# EAGLE design FDevT (EAGLE 9.1.1)
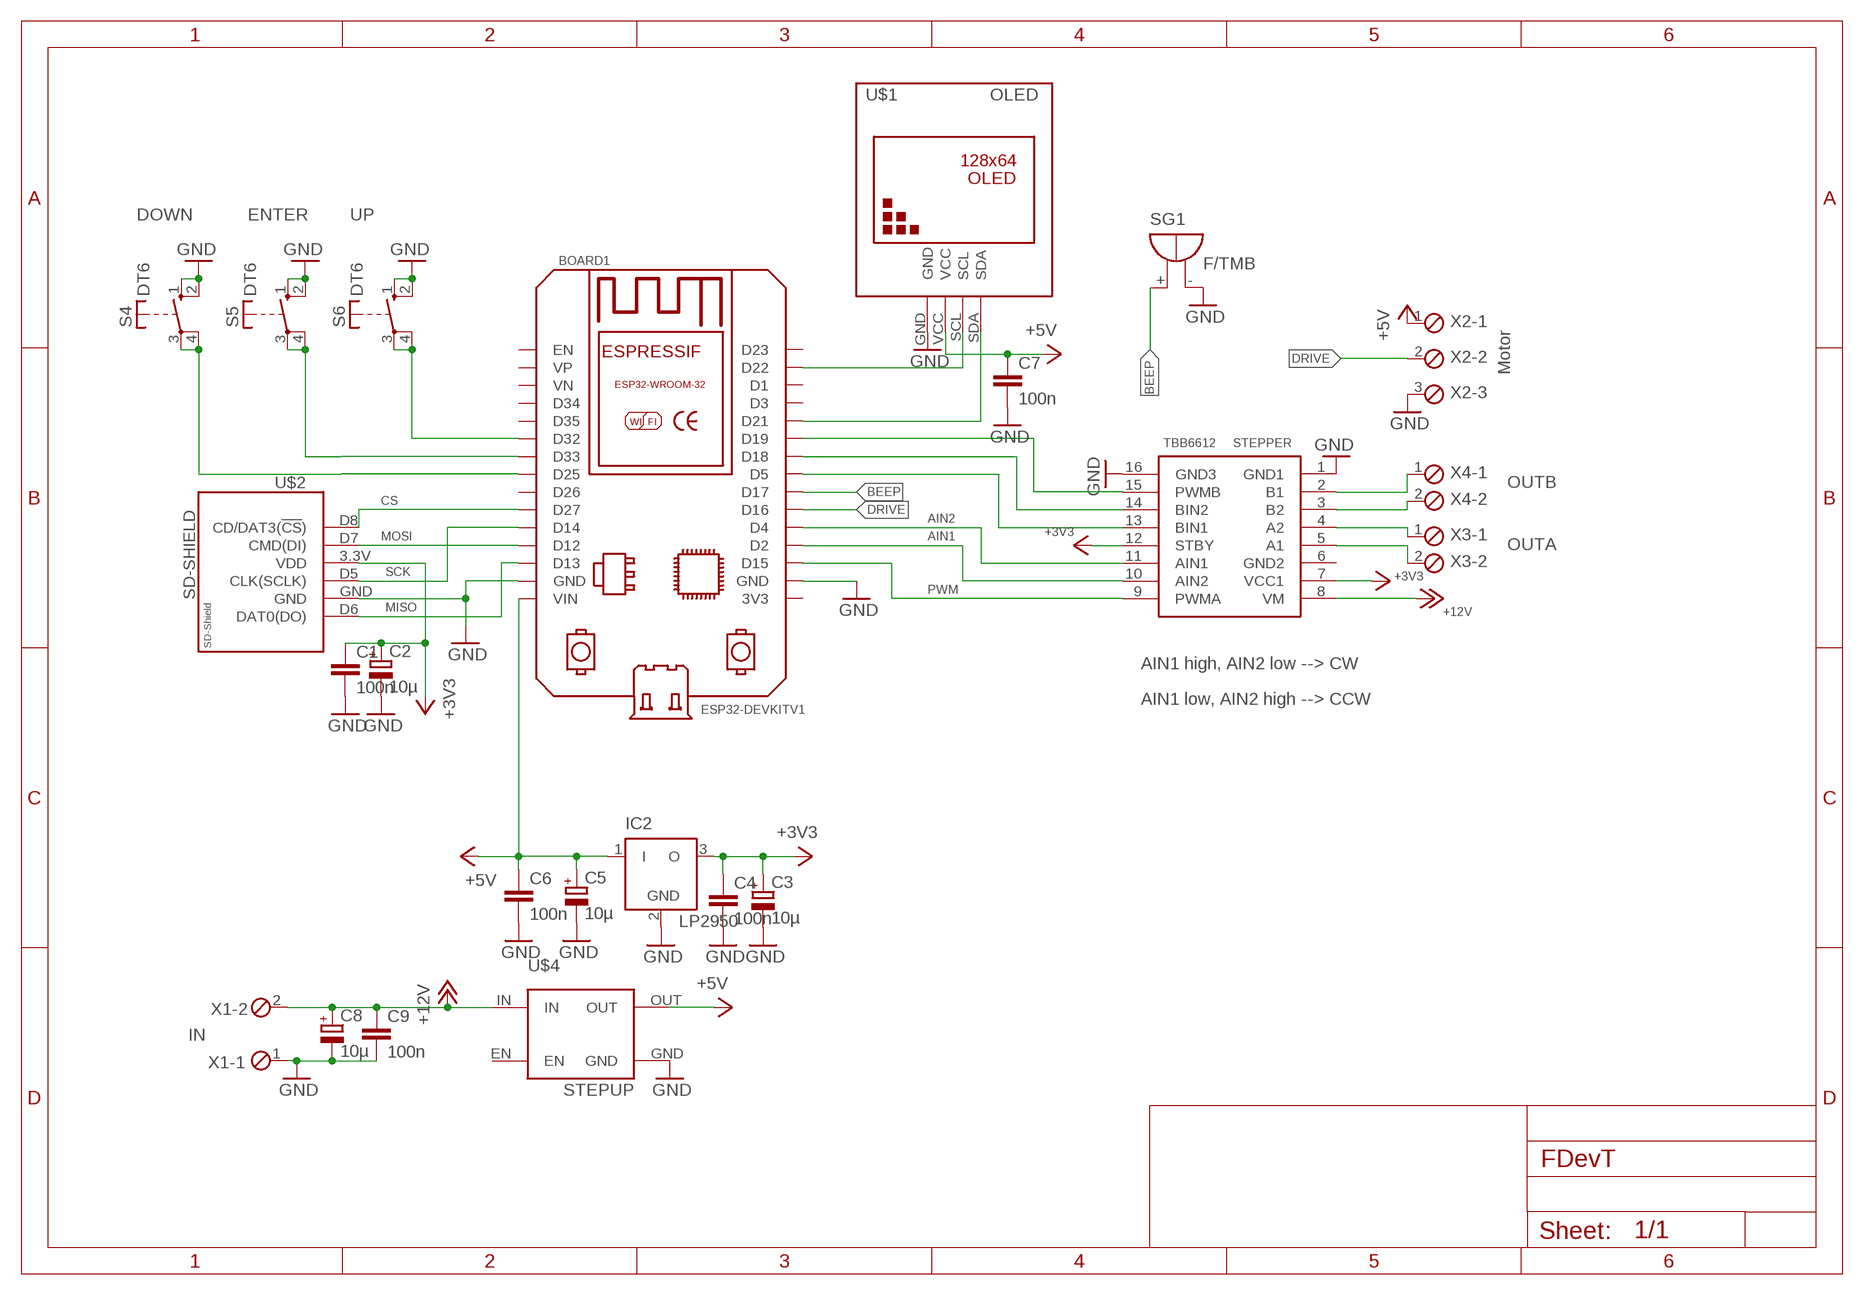
[diagram p0: schematic, sheet 1]

## Parts
BOARD1  ESP32DEVKITV1  [ESP32-DEVKITV1]
C1  100n  C-EUC0805  [C0805]
C2  10µ  CPOL-EUSMCB  [SMC_B]
C3  10µ  CPOL-EUSMCB  [SMC_B]
C4  100n  C-EUC0805  [C0805]
C5  10µ  CPOL-EUSMCB  [SMC_B]
C6  100n  C-EUC0805  [C0805]
C7  100n  C-EUC0805  [C0805]
C8  10µ  CPOL-EUSMCB  [SMC_B]
C9  100n  C-EUC0805  [C0805]
IC2  LP2950  [DPACK]
S4  DT6  [DT6]
S5  DT6  [DT6]
S6  DT6  [DT6]
SG1  F/TMB  [F/TMB]
STEPPER  TBB6612  [DRIVER]
U$1  OLED  [SIP]
U$2  SD-SHIELD  [SD_SHIELD]
U$4  STEPUP  [STEPUP]
X1  IN  MPT2  [2POL254]
X2  Motor  MPT3  [3POL254]
X3  OUTA  MPT2  [2POL254]
X4  OUTB  MPT2  [2POL254]

## Nets
+3V3: C1.1 C2.+ C3.+ C4.1 IC2.3(O) STEPPER.7(VCC1) STEPPER.12(STBY) U$2.3.3V(VDD)
+5V: BOARD1.VIN C5.+ C6.1 C7.1 IC2.1(I) U$1.VCC U$4.OUT X2.1
+12V: C8.+ C9.1 STEPPER.8(VM) U$4.IN X1.2
AIN1: BOARD1.D2 STEPPER.10(AIN2)
AIN2: BOARD1.D4 STEPPER.11(AIN1)
BEEP: BOARD1.D17 SG1.+
CS: BOARD1.D27 U$2.D8(CD/DAT3(!CS!))
DOWN: BOARD1.D25 S4.3(P) S4.4(P)
DRIVE: BOARD1.D16 X2.2
ENTER: BOARD1.D33 S5.3(P) S5.4(P)
GND: BOARD1.GND BOARD1.GND@1(GND) C1.2 C2.- C3.- C4.2 C5.- C6.2 C7.2 C8.- C9.2 IC2.2(GND) S4.1(S) S4.2(S) S5.1(S) S5.2(S) S6.1(S) S6.2(S) SG1.- STEPPER.1(GND1) STEPPER.16(GND3) U$1.GND U$2.GND U$4.GND X1.1 X2.3
MISO: BOARD1.D13 U$2.D6(DAT0(DO))
MOSI: BOARD1.D12 U$2.D7(CMD(DI))
N$1: BOARD1.D22 U$1.SCL
N$2: BOARD1.D21 U$1.SDA
N$3: STEPPER.5(A1) X3.2
N$4: STEPPER.4(A2) X3.1
N$5: BOARD1.D5 STEPPER.13(BIN1)
N$6: BOARD1.D18 STEPPER.14(BIN2)
N$7: BOARD1.D19 STEPPER.15(PWMB)
N$8: STEPPER.3(B2) X4.2
N$9: STEPPER.2(B1) X4.1
PWM: BOARD1.D15 STEPPER.9(PWMA)
SCK: BOARD1.D14 U$2.D5(CLK(SCLK))
UP: BOARD1.D32 S6.3(P) S6.4(P)
Unconnected: BOARD1.3V3 BOARD1.D1 BOARD1.D3 BOARD1.D23 BOARD1.D26 BOARD1.D34 BOARD1.D35 BOARD1.EN BOARD1.VN BOARD1.VP STEPPER.6(GND2) U$4.EN

## Notes on the sheet
- AIN1 high, AIN2 low --> CW
- AIN1 low, AIN2 high --> CCW

## Library data of the parts
BOARD1 = ESP32-DEVKITV1:ESP32DEVKITV1: https://github.com/shridattdudhat
C1 C4 C6 C7 C9 = rcl:C-EU: CAPACITOR, European symbol
C2 C3 C5 C8 = rcl:CPOL-EU: POLARIZED CAPACITOR, European symbol
IC2 = linear:LP2950: 100 mA, Low Power Low Dropout Voltage Regulator Source: http://www.onsemi.com/pub/Collateral/LP2950-D.PDF
S4-S6 = switch-misc:DT: ITT SWITCH
SG1 = buzzer:F/TMB: BUZZER Source: Buerklin; OC_FARNELL: unknown; OC_NEWARK: unknown
STEPPER = TBB6612d:TBB6612
U$1 = OLED:OLED: I2C 0.91"128x32 OLED
U$2 = sd-mmc:SD-SHIELD
U$4 = AMESYS_neu:STEPUP
X1 X3 X4 = con-phoenix-254:MPT2: PHOENIX CONNECTOR; OC_FARNELL: unknown; OC_NEWARK: unknown
X2 = con-phoenix-254:MPT3: PHOENIX CONNECTOR; OC_FARNELL: unknown; OC_NEWARK: unknown

## Board
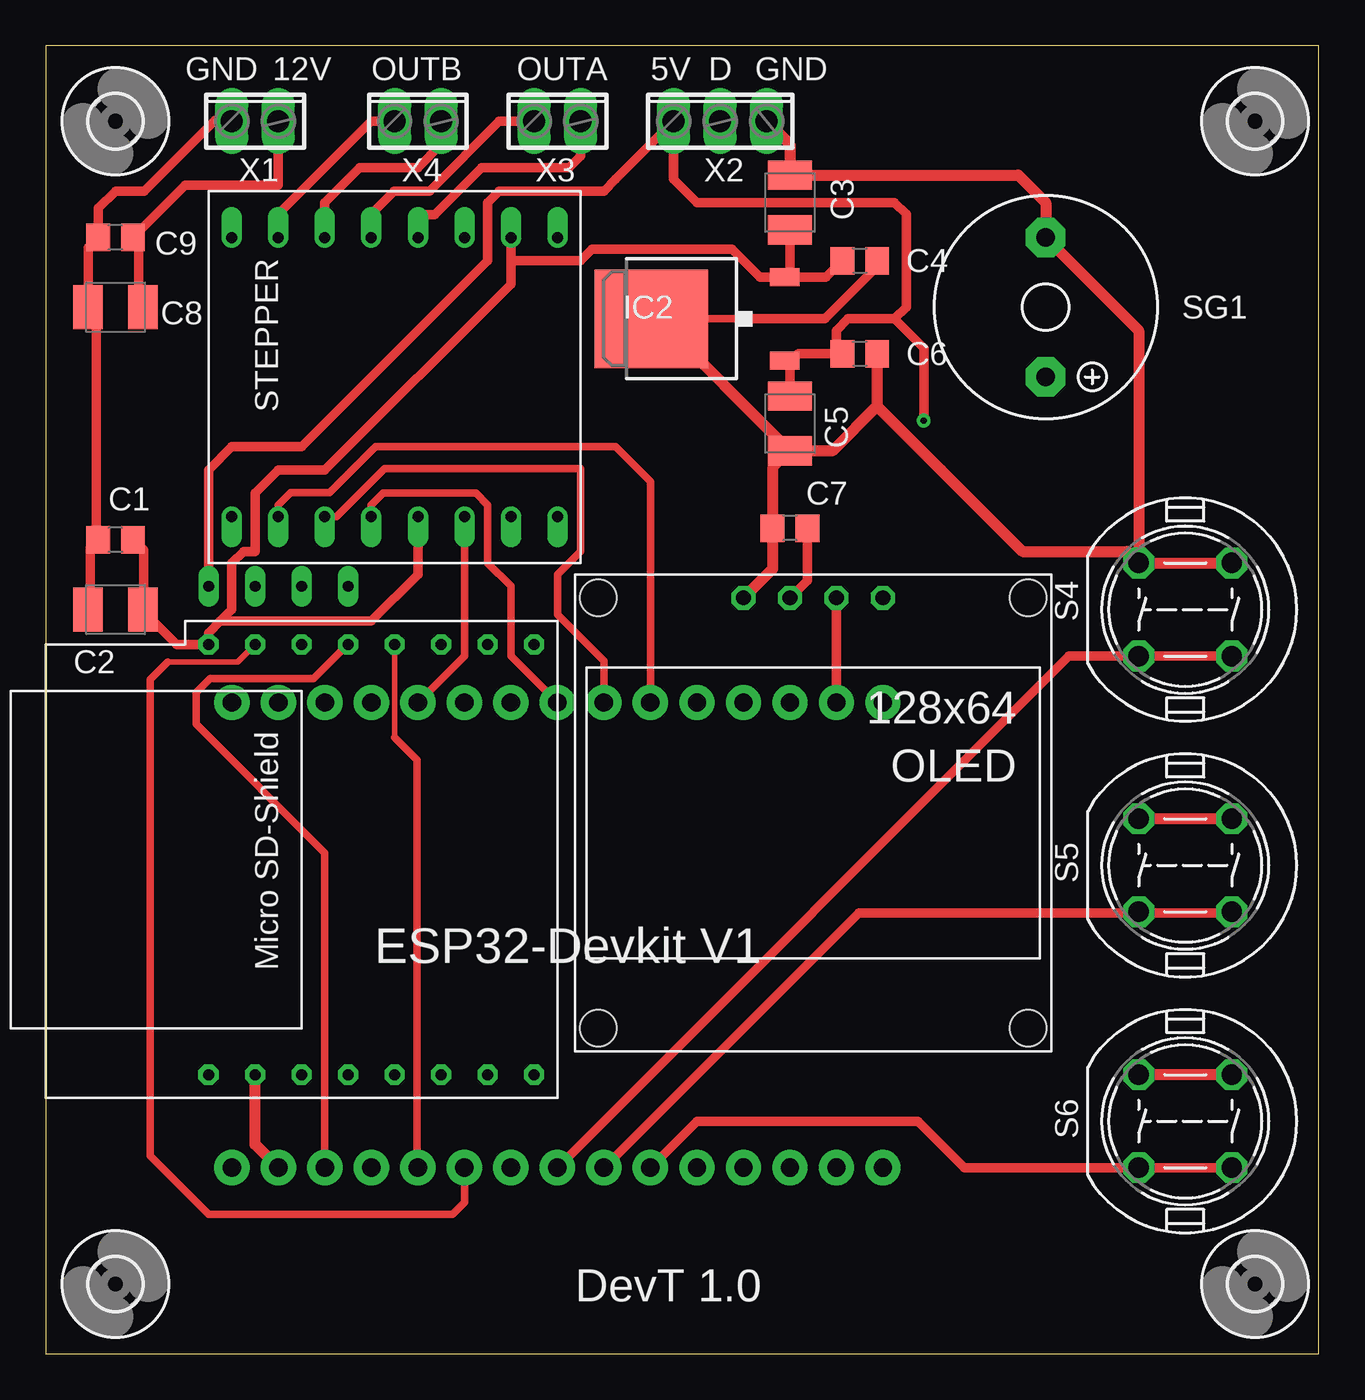
[diagram p1: board, top side]
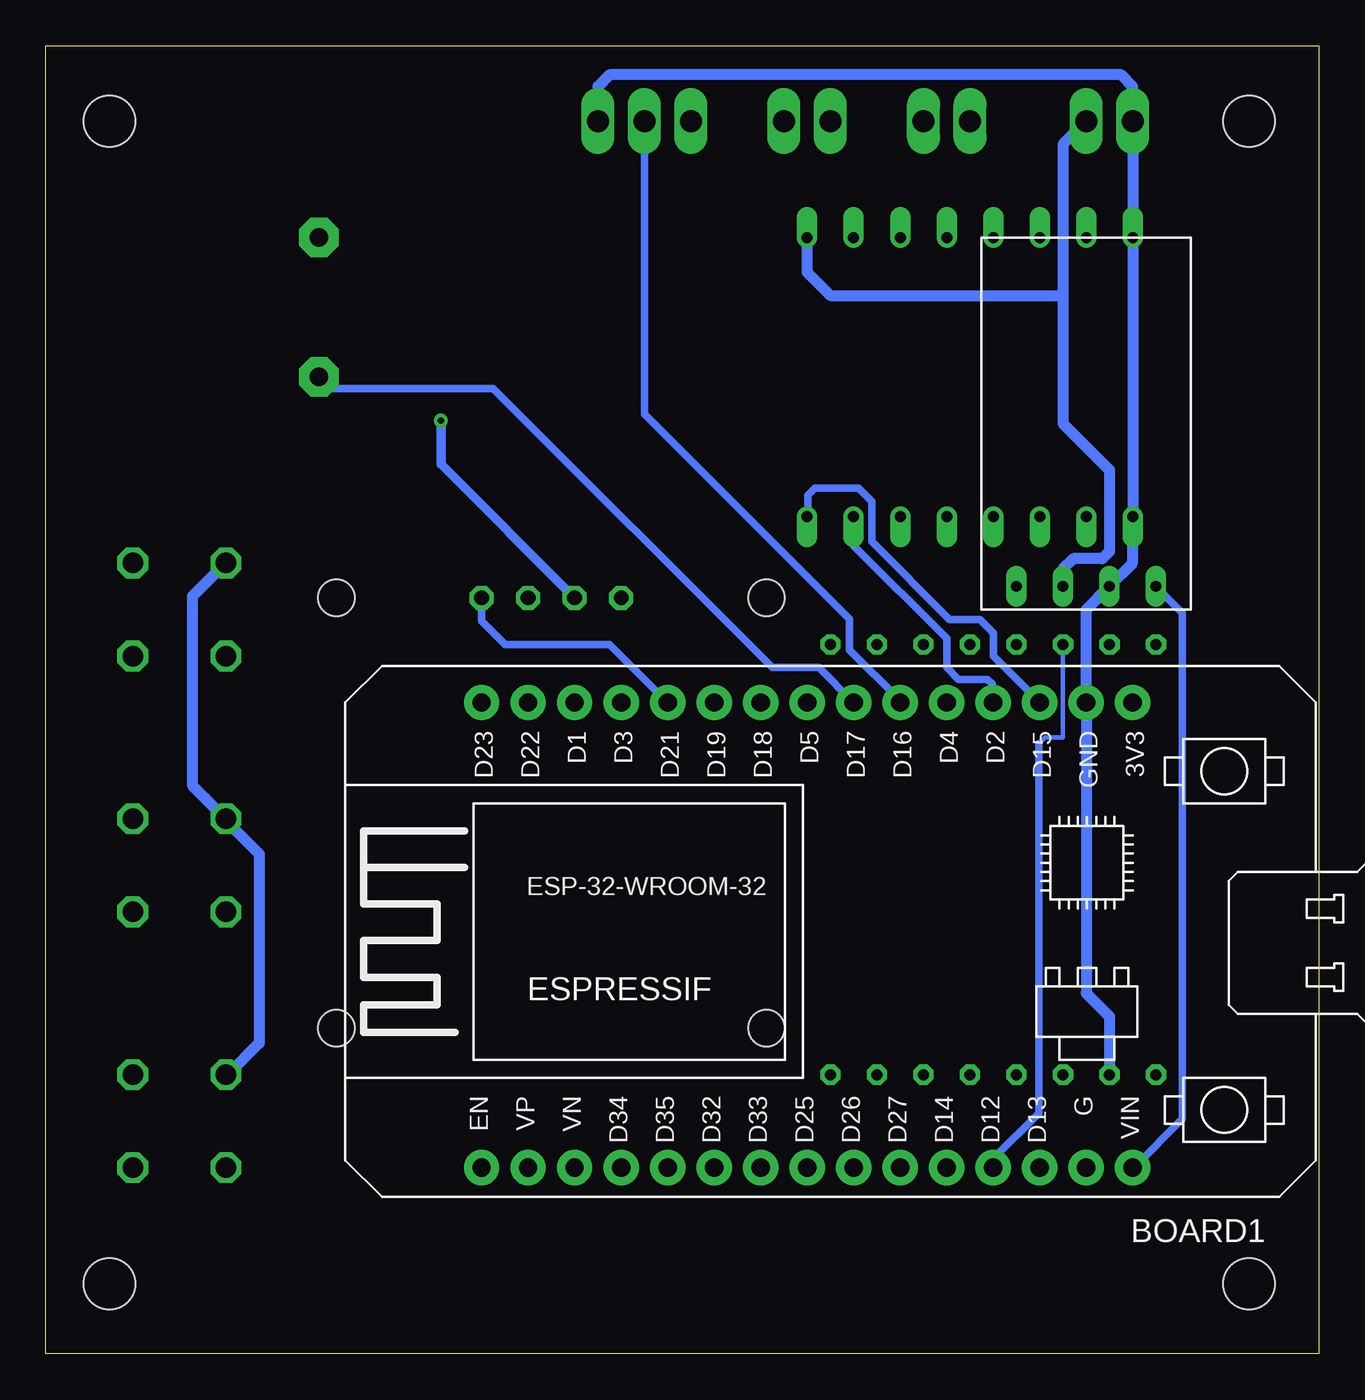
[diagram p2: board, bottom side, seen from below]

Size 69.52 x 71.43 mm. Coordinates in mm from the lower left corner, seen from the top.
Outline: 0,0 69.52,0 69.52,71.43 0,71.43 0,0
Copper layers (1*16): Top 0.035mm / dielectric 1.5mm / Bottom 0.035mm
Design rules "default": minimum track width 6mil, minimum drill 0.35mm, track to track 6mil, track to pad 6mil, pad to pad 6mil, via to via 6mil, smd to smd 6mil, copper to edge 40mil, drill to drill 6mil, minimum pad ring 10mil, minimum via ring 8mil, stop-mask expansion 4mil, vias tented up to drill 0mil, thermal gap 10mil

### Footprints (pad centres in the part's own frame; a part is rotated, then mirrored left to right if it is on the bottom)
ESP32-DEVKITV1 = drill 1 pad 1.93: 3V3 0,0; D1 30.48,0; D2 7.62,0; D3 27.94,0; D4 10.16,0; D5 17.78,0; D12 7.62,25.4; D13 5.08,25.4; D14 10.16,25.4; D15 5.08,0; D16 12.7,0; D17 15.24,0; D18 20.32,0; D19 22.86,0; D21 25.4,0; D22 33.02,0; D23 35.56,0; D25 17.78,25.4; D26 15.24,25.4; D27 12.7,25.4; D32 22.86,25.4; D33 20.32,25.4; D34 27.94,25.4; D35 25.4,25.4; EN 35.56,25.4; GND 2.54,25.4; GND@1 2.54,0; VIN 0,25.4; VN 30.48,25.4; VP 33.02,25.4
C0805 = smd 1.3 x 1.5: 1 -0.95,0; 2 0.95,0
SMC_B = smd 1.6 x 2.4: + -1.5,0; - 1.5,0
DPACK = smd 1 x 1.6: 1 -2.28,-4.8; 3 2.28,-4.8 | smd 5.4 x 6.2: 2 0,2.5
DT6 = drill 1.118 octagon: 1 -2.54,2.54; 2 2.54,2.54; 3 2.54,-2.54; 4 -2.54,-2.54
F/TMB = drill 1.016 pad 2.159 octagon: + 3.81,0; - -3.81,0
DRIVER = drill 0.6 offset: 1 -1.27,-3.81; 2 -1.27,-1.27; 3 -1.27,1.27; 4 -1.27,3.81; 5 -1.27,6.35; 6 -1.27,8.89; 7 -1.27,11.43; 8 -1.27,13.97; 9 13.97,13.97; 10 13.97,11.43; 11 13.97,8.89; 12 13.97,6.35; 13 13.97,3.81; 14 13.97,1.27; 15 13.97,-1.27; 16 13.97,-3.81
SIP = drill 0.8 octagon: GND 9.207,24.765; SCL 14.287,24.765; SDA 16.828,24.765; VCC 11.748,24.765 | hole 2: 1.27,24.765; 24.765,24.765; 24.765,1.27; 1.27,1.27
SD_SHIELD = drill 0.6 octagon: 3.3V 8.89,24.765; 5V 8.89,1.27; A0 24.13,24.765; D0 21.59,24.765; D1 21.59,1.27; D2 19.05,1.27; D3 16.51,1.27; D4 13.97,1.27; D5 19.05,24.765; D6 16.51,24.765; D7 13.97,24.765; D8 11.43,24.765; GND 11.43,1.27; RST 26.67,24.765; RX 24.13,1.27; TX 26.67,1.27
STEPUP = drill 0.6 long: EN 0,3.81; GND 0,-1.27; IN 0,1.27; OUT 0,-3.81
2,8 = hole 2.8: 0,0
2POL254 = drill 1.2 long: 1 -1.27,0; 2 1.27,0
3POL254 = drill 1.2 long: 1 -2.54,0; 2 0,0; 3 2.54,0

### Placement (x,y rotation side)
BOARD1  10.16,35.56 180 bottom
C1  3.81,44.45 180 top
C2  3.81,40.64 180 top
C3  40.64,62.87 90 top
C4  44.45,59.69 0 top
C5  40.64,50.8 270 top
C6  44.45,54.61 0 top
C7  40.64,45.09 180 top
C8  3.81,57.15 180 top
C9  3.81,60.96 180 top
IC2  35.56,56.52 90 top
S4  62.23,40.64 0 top
S5  62.23,26.67 0 top
S6  62.23,12.7 0 top
SG1  54.61,57.15 270 top
STEPPER  13.97,59.69 270 top
U$1  28.89,16.51 0 top
U$2  0,13.97 0 top
U$4  12.7,41.91 90 bottom
U$5  [2,8]  3.81,3.81 0 top
U$6  [2,8]  66.04,3.81 0 top
U$7  [2,8]  66.04,67.31 0 top
U$8  [2,8]  3.81,67.31 0 top
X1  11.43,67.31 0 top
X2  36.83,67.31 0 top
X3  27.94,67.31 0 top
X4  20.32,67.31 0 top

### Tracks (layer width: path | path; a pad name or v marks a point on that pad's centre or on a via)
+3V3
  Top 0.152: 5.16,40.72 5.18,40.69 C2.+ 5.33,40.54
  Top 0.508: C1.1 5.33,43.88 5.33,40.54 | 5.16,40.72 7.14,38.73 U$2.3.3V 8.89,39.37 9.53,40.01 | 9.53,40.01 10.16,40.64 10.16,43.18 10.79,43.81 11.43,43.81 11.43,46.99 12.7,48.26 15.24,48.26 25.4,58.42 25.4,59.69 | STEPPER.12 20.32,42.55 17.78,40.01 9.53,40.01 | STEPPER.7 25.4,59.69 | IC2.3 40.64,59.08 C3.+ | C4.1 42.6,58.8 IC2.3 | IC2.3 38.99,58.8 37.47,60.33 29.84,60.33 29.21,59.69 25.4,59.69
+5V  (via drill 0.35)
  Top 0.152: 43.43,54.71 C6.1 | 34.29,67.21 X2.1 34.29,67.21
  Top 0.406: IC2.1 40.64,53.95 C5.+
  Top 0.508: U$4.OUT 8.89,48.26 10.16,49.53 13.97,49.53 24.13,59.69 24.13,62.87 24.77,63.5 25.4,63.5 30.48,63.5 31.11,64.14 X2.1 34.29,64.14 35.56,62.87 46.35,62.87 46.99,62.23 46.99,57.15 46.35,56.52 | 43.43,54.71 43.18,54.97 43.18,55.88 43.81,56.52 46.35,56.52 | C7.1 41.59,42.23 U$1.VCC | C6.1 41.12,54.61 40.64,54.13 C5.+ | v47.94,50.96 47.94,54.93 46.35,56.52
  Bottom 0.152: 8.84,41.91 U$4.OUT | 10.06,10.21 BOARD1.VIN
  Bottom 0.406: 8.84,41.91 8.84,41.83 7.44,40.44 7.44,12.83 10.06,10.21
  Bottom 0.508: v47.94,50.96 47.94,48.58 U$1.VCC
+12V
  Top 0.152: 4.88,60.96 C9.1 4.88,60.96 | 5.24,57.15 C8.+ 5.24,57.15
  Top 0.406: C8.+ 5.08,57.15
  Top 0.508: X1.2 12.7,63.82 7.62,63.82 C9.1 5.08,60.64 5.08,57.15
  Bottom 0.61: X1.2 13.97,66.04 13.97,57.78 | U$4.IN 13.97,42.87 13.41,43.42 11.82,43.42 11.43,43.81 11.43,48.26 13.97,50.8 13.97,57.78 | STEPPER.8 27.94,59.05 26.67,57.78 13.97,57.78
AIN1
  Bottom 0.152: 17.83,35.66 BOARD1.D2
  Bottom 0.406: STEPPER.10 25.4,44.13 20.32,39.05 20.32,37.47 19.68,36.83 18.1,36.83 17.83,36.56 17.83,35.66
AIN2
  Top 0.152: STEPPER.11 22.86,38.1
  Top 0.406: BOARD1.D4 22.86,38.1 STEPPER.11
BEEP
  Bottom 0.406: SG1.+ 53.98,52.7 45.09,52.7 29.84,37.47 27.3,37.47 BOARD1.D17
CS
  Top 0.152: 22.86,10.06 BOARD1.D27
  Top 0.305: U$2.D8 10.48,37.78 6.67,37.78
  Top 0.406: 6.67,37.78 5.71,36.83 5.71,10.79 8.89,7.62 22.23,7.62 22.86,8.26 22.86,10.06
DOWN
  Top 0.152: 59.59,38.1 S4.4
  Top 0.508: S4.3 59.59,38.1 55.88,38.1 BOARD1.D25
DRIVE
  Bottom 0.152: 22.86,35.66 BOARD1.D16
  Bottom 0.406: 22.86,35.66 25.63,38.43 25.63,40.12 36.83,51.32 X2.2
ENTER
  Top 0.152: 59.59,24.08 S5.4
  Top 0.508: S5.3 64.72,24.08 59.69,24.08 | 59.69,24.08 59.59,24.08 | BOARD1.D33 44.4,24.08 59.69,24.08
GND
  Top 0.152: 2.74,44.35 C1.2 | 2.44,40.69 C2.- | 33.34,56.52 IC2.2 | 10.21,67.36 X1.1 | 2.44,57.15 C8.- 2.44,57.15 | 38.1,41.3 38.41,41.6 U$1.GND 38.1,41.3
  Top 0.406: 37.78,56.52 33.34,56.52
  Top 0.508: 10.21,67.36 9.25,67.36 5.39,63.5 3.81,63.5 2.86,62.55 C9.2 2.31,60.41 C8.- 2.74,56.72 2.74,46.99 2.74,44.35 | C1.2 2.44,44.03 2.44,40.69 | C6.2 45.4,51.75 | 59.05,43.81 S4.1 | C7.2 39.69,44.45 | C5.- 39.69,48.35 | C4.2 45.4,59.37 42.55,56.52 37.78,56.52 | 33.42,56.52 33.34,56.52 IC2.2
  Top 0.61: X2.3 40.64,66.04 C3.- 53.11,64.36 54.61,62.87 SG1.- 59.69,55.88 S4.1 S4.2 | 45.4,51.75 42.95,49.3 C5.- 33.42,56.52 | C6.2 45.4,51.76 48.9,48.26 53.34,43.81 59.05,43.81 | U$1.GND 39.69,42.87 39.69,44.45 39.69,48.35 | S5.2 S5.1 | S6.2 S6.1 | BOARD1.GND 11.43,11.43 U$2.GND
  Bottom 0.152: 59.59,15.24 S6.1
  Bottom 0.406: S5.1 59.69,29.11
  Bottom 0.61: U$2.GND 11.43,18.41 12.7,19.68 BOARD1.GND@1 12.7,40.64 U$4.GND 10.16,43.18 STEPPER.16 STEPPER.1 X1.1 10.16,69.2 10.79,69.84 38.73,69.84 39.37,69.2 X2.3 | S4.1 61.52,41.35 61.52,31.04 60.81,30.33 S5.1 | 59.69,29.11 57.86,27.28 57.86,16.97 59.59,15.24
MISO
  Top 0.152: 16.46,38.71 U$2.D6
  Top 0.406: 16.46,38.71 14.63,36.88 8.98,36.88 8.2,36.11 8.2,34.38 15.24,27.34 BOARD1.D13
MOSI
  Bottom 0.152: 17.68,10.21 BOARD1.D12
  Bottom 0.254: U$2.D7 13.97,33.66 14.95,33.66 15.29,33.31
  Bottom 0.406: 15.29,33.31 15.29,13.13 17.68,10.74 17.68,10.21
N$1
  Top 0.508: U$1.SCL BOARD1.D22
N$2
  Bottom 0.406: BOARD1.D21 38.73,38.73 44.45,38.73 45.72,40.01 U$1.SDA
N$3
  Top 0.508: STEPPER.5 20.32,62.2 21.23,62.2 23.79,64.77 28.57,64.77 29.21,65.41 X3.2
N$4
  Top 0.508: STEPPER.4 17.78,62.23 19.02,63.48 19.96,63.48 19.98,63.5 20.95,63.5 24.77,67.31 X3.1
N$5
  Top 0.406: BOARD1.D5 25.4,38.1 25.4,41.91 24.13,43.18 24.13,46.35 23.5,46.99 18.41,46.99 17.78,46.35 STEPPER.13 | STEPPER.13 17.78,45.09 STEPPER.13
N$6
  Top 0.406: BOARD1.D18 30.48,37.82 27.94,40.36 27.94,42.54 27.94,42.55 29.21,43.81 29.21,48.34 18.49,48.34 15.88,45.72 STEPPER.14
N$7
  Top 0.406: BOARD1.D19 33.02,47.62 31.11,49.53 18.01,49.53 15.49,47.02 13.36,47.02 12.7,46.35 STEPPER.15
N$8
  Top 0.508: X4.2 21.59,66.04 20.32,64.77 17.14,64.77 15.24,62.87 STEPPER.3
N$9
  Top 0.508: STEPPER.2 12.7,62.23 17.78,67.31 X4.1
PWM
  Bottom 0.152: 27.89,45.72 STEPPER.9
  Bottom 0.406: 27.89,45.72 27.89,46.89 27.51,47.27 25.15,47.27 24.41,46.53 24.41,44.35 20.17,40.11 18.52,40.11 17.78,39.37 17.78,38.1 BOARD1.D15
SCK
  Top 0.305: 19.05,33.66 U$2.D5
  Top 0.406: BOARD1.D14 20.27,10.21 20.27,15.24 20.27,32.44 19.05,33.66
UP
  Top 0.152: 59.59,10.21 S6.4
  Top 0.508: S6.3 59.64,10.16 59.59,10.21 | S6.4 50.16,10.16 47.62,12.7 35.56,12.7 BOARD1.D32

### Text on the board
tNames: GND | 12V | OUTB | OUTA | 5V | D | GND | DevT 1.0